# Altium project BusServoCtrl.PrjPcb
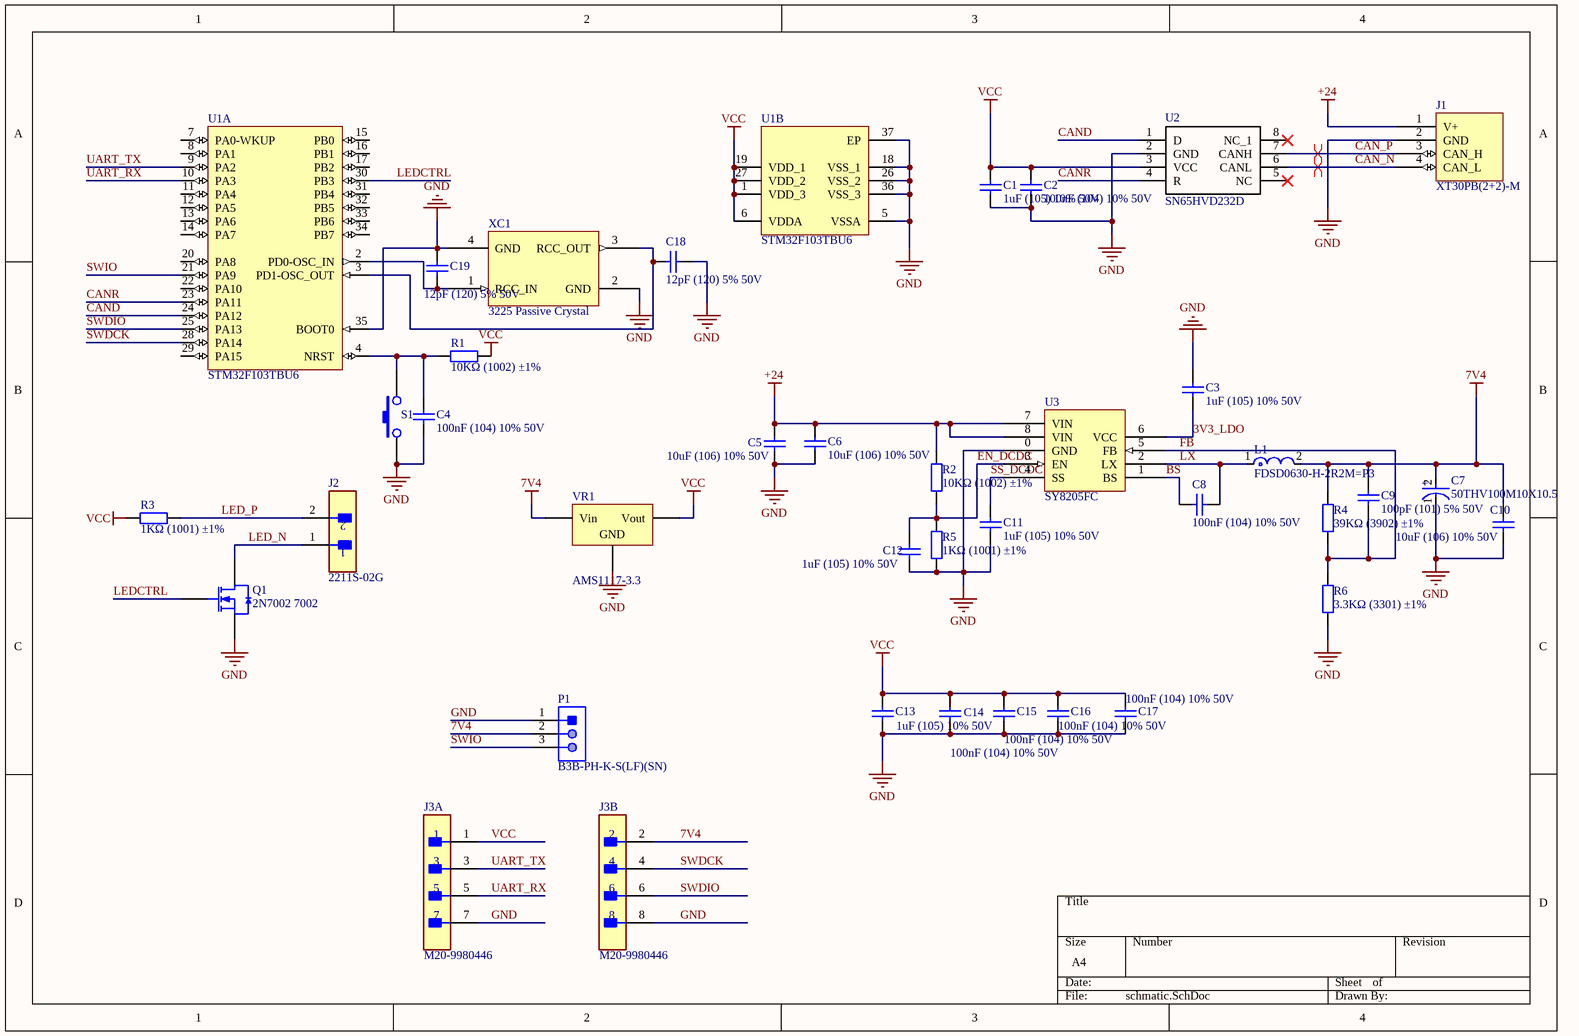
[diagram p0: schmatic.SchDoc]
1 sheet, 37 parts. Net scope: global (net labels, ports and power ports of the same name join across sheets).
Board file: PCB.PcbDoc

## Sheet schmatic.SchDoc
size A4; SheetNumber: 1; SheetTotal: 1

### Parts
C1  1uF (105) 10% 50V  [0603_C]
C2  100nF (104) 10% 50V  [0603_C]
C3  1uF (105) 10% 50V  [0603_C]
C4  100nF (104) 10% 50V  [0603_C]
C5  10uF (106) 10% 50V  [1206_C]
C6  10uF (106) 10% 50V  [1206_C]
C7  50THV100M10X10.5  [FP-THV10X10_5-MFG]
C8  100nF (104) 10% 50V  [0603_C]
C9  100pF (101) 5% 50V  [0603_C]
C10  10uF (106) 10% 50V  [1206_C]
C11  1uF (105) 10% 50V  [0603_C]
C12  1uF (105) 10% 50V  [0603_C]
C13  1uF (105) 10% 50V  [0603_C]
C14  100nF (104) 10% 50V  [0603_C]
C15  100nF (104) 10% 50V  [0603_C]
C16  100nF (104) 10% 50V  [0603_C]
C17  100nF (104) 10% 50V  [0603_C]
C18  12pF (120) 5% 50V  [0603_C]
C19  12pF (120) 5% 50V  [0603_C]
J1  XT30PB(2+2)-M  [XT30PB(2+2)-M-Footprint-1]
J2  2211S-02G  [FP-2211S-02G-MFG]
J3  M20-9980446  [FP-M20-9980446-MFG]  (parts A,B of 2)
L1  FDSD0630-H-2R2M=P3  [FP-FDSD0630-MFG]
P1  B3B-PH-K-S(LF)(SN)  [JST-B3B-PH-K-S-3_V]
Q1  2N7002 7002  [SOT-23(SOT-23-3)]
R1  10KΩ (1002) ±1%  [0603_R]
R2  10KΩ (1002) ±1%  [0603_R]
R3  1KΩ (1001) ±1%  [0603_R]
R4  39KΩ (3902) ±1%  [0603_R]
R5  1KΩ (1001) ±1%  [0603_R]
R6  3.3KΩ (3301) ±1%  [0603_R]
S1  按键  [SWT3*4]  (value not drawn)
U1  STM32F103TBU6  [STM-VFQFPN36_L]  (parts A,B of 2)
U2  SN65HVD232D  [SOIC127P600X175-8N]
U3  SY8205FC  [SOP-8_EP_150mil]
VR1  AMS1117-3.3  [SOT-223]
XC1  3225 Passive Crystal  [SMD-3225]

### Nets
7V4: C7.2(A) C9.2 C10.2 J3.2 L1.2 P1.2 R4.2 VR1.3(Vin)
+24: C5.2 C6.2 J1.1(V+) R2.2 U3.7(VIN) U3.8(VIN)
GND: C1.1 C2.1 C3.2 C4.1 C5.1 C6.1 C7.1(C) C10.1 C11.1 C12.1 C13.1 C14.1 C15.1 C16.1 C17.1 C18.2 C19.2 J1.2(GND) J3.7 J3.8 P1.1 Q1.2(S) R5.1 R6.1 S1.1 U1.5(VSSA) U1.18(VSS_1) U1.26(VSS_2) U1.35(BOOT0) U1.36(VSS_3) U1.37(EP) U2.2(GND) U3.0(GND) VR1.1(GND) XC1.2(GND) XC1.4(GND)
VCC: C1.2 C2.2 C13.2 C14.2 C15.2 C16.2 C17.2 J3.1 R1.2 R3.2 U1.1(VDD_3) U1.6(VDDA) U1.19(VDD_1) U1.27(VDD_2) U2.3(VCC) VR1.2(Vout)
3V3_LDO: C3.1 U3.6(VCC)
BS: C8.1 U3.1(BS)
CAN_N: J1.4(CAN_L) U2.6(CANL)
CAN_P: J1.3(CAN_H) U2.7(CANH)
CAND: U1.24(PA12) U2.1(D)
CANR: U1.23(PA11) U2.4(R)
EN_DCDC: C12.2 R2.1 R5.2 U3.3(EN)
FB: C9.1 R4.1 R6.2 U3.5(FB)
LED_N: J2.1 Q1.3(D)
LED_P: J2.2 R3.1
LEDCTRL: Q1.1(G) U1.30(PB3)
LX: C8.2 L1.1 U3.2(LX)
SS_DCDC: C11.2 U3.4(SS)
SWDCK: J3.4 U1.28(PA14)
SWDIO: J3.6 U1.25(PA13)
SWIO: P1.3 U1.21(PA9)
UART_RX: J3.5 U1.10(PA3)
UART_TX: J3.3 U1.9(PA2)
NetC4_2: C4.2 R1.1 S1.2 U1.4(NRST)
NetC18_1: C18.1 U1.3(PD1-OSC_OUT) XC1.3(RCC_OUT)
NetC19_1: C19.1 U1.2(PD0-OSC_IN) XC1.1(RCC_IN)

Not connected (* = marked no-connect by the designer): U1 7(PA0-WKUP) 8(PA1) 11(PA4) 12(PA5) 13(PA6) 14(PA7) 15(PB0) 16(PB1) 17(PB2) 20(PA8) 22(PA10) 29(PA15) 31(PB4) 32(PB5) 33(PB6) 34(PB7); U2 5(NC)* 8(NC_1)*

### Layout directives
differential pair: CAN_N, CAN_P

### Notes on the sheet
- (in symbol CMP-35376-000015-1) +

### Library data of the parts
C1 C3 C11-C13 = 0603 1uF (105) 10% 50V: 贴片电容; ComponentLink1Description: 供应商链接; ComponentLink1URL: http://www.szlcsc.com/product/details_16531.html; Package: 0603; Supplier: LC; SuppliersPartNumber: C15849
C2 C4 C8 C14-C17 = 0603 100nF (104) 10% 50V: 贴片电容; ComponentLink1Description: 供应商链接; ComponentLink1URL: http://www.szlcsc.com/product/details_15331.html; Package: 0603; Supplier: LC; SuppliersPartNumber: C14663
C5 C6 C10 = 1206 10uF (106) 10% 50V: 贴片电容; ComponentLink1Description: 供应商链接; ComponentLink1URL: http://www.szlcsc.com/product/details_14236.html; Package: 1206; Supplier: LC; SuppliersPartNumber: C13585
C7 = CMP-35376-000015-1: CAP ALUM 100UF 20% 50V SMD; Ripple Current: 175mA; Ripple Current (AC): 350mA; ESR (Equivalent Series Resistance): 250mR; Life (Hours): 3000Hour; Max Operating Temperature: 125°C; Height: 10.5mm; Package Quantity: 1; Radiation Hardening: No; Diameter: 10mm; Capacitance: 100uF; Case/Package: Radial; RoHS Compliant: Yes; Voltage: 50V; REACH SVHC: No SVHC; Packaging: Cut Tape; Height - Seated (Max): 0.413inch; Voltage Rating: 50V; Min Operating Temperature: -40°C; Mount: Surface Mount; Termination: SMD/SMT; Series: THV; Construction: Cylindrical; Voltage Rating (DC): 50V; Tolerance: 20%
C9 = 0603 100pF (101) 5% 50V: 贴片电容; ComponentLink1Description: 供应商链接; ComponentLink1URL: http://www.szlcsc.com/product/details_15530.html; Package: 0603; Supplier: LC; SuppliersPartNumber: C14858
C18 C19 = 0603 12pF (120) 5% 50V: 贴片电容; ComponentLink1Description: 供应商链接; ComponentLink1URL: http://www.szlcsc.com/product/details_39506.html; Package: 0603; Supplier: LC; SuppliersPartNumber: C38523
J1 = CMP-002-00072-5: This is a power connector that can also be used to send/receive can signals; Gender: Male; Pins: 4
J2 = CMP-12414-000006-2: 2.54mm pitch, single row PCB headers.; Gender: Male; Number of Contacts: 2; Insulation Resistance: 1GR; Height: 0.47inch; REACH SVHC: No SVHC; Termination: Through Hole; Contact Material: Copper Alloy; Weight: 0.11lb; Length: 0.2inch; Flammability Rating: UL94 V-0; Contact Plating: Gold; Mount: Through Hole; Number of Rows: 1; RoHS Compliant: No; Width: 0.12inch
J3 = CMP-15831-000088-1: CONN HEADER VERT 8POS 2.54MM; Row Spacing: 0.1inch; Current Rating: 3A; Mated Stacking Heights: 16.54mm; Insulation Resistance: 10GR; Connector Type: Male Pin; Gender: Male; Number of Contacts: 8; Contact Resistance: 30mR; Contact Material: Brass; Series: M20; Max Operating Temperature: 105°C; REACH SVHC: No SVHC; Flammability Rating: UL94 V-0; Number of Rows: 2; Mount: Through Hole; Contact Plating: Tin; Min Operating Temperature: -40°C; Packaging: Bulk; Radiation Hardening: No; Insulation Material: Nylon; Orientation: Straight; Contact Shape: Square; Max Current Rating: 3A; Contact Type: Male Pin; Depth: 5.08mm; Color: Black; Contact Finish - Mating: TIN; Length: 10.16mm; Housing Color: Black; Package Quantity: 1000; Pitch: 2.54mm; Contact Mating Length: 0.24inch; Termination: Solder; Housing Material: Nylon; Fastening Type: Pull; Insulation Color: Black; Number of Positions: 8; RoHS Compliant: Yes
L1 = CMP-06042-016400-1: FIXED IND 2.2UH 7.1A 17 MOHM SMD; Saturation Current: 12A; Test Frequency: 100kHz; DC Resistance (DCR): 17mR; Shielding: Shielded; Tolerance: 20%; Core Material: Ferrite; Height - Seated (Max): 0.118inch; Depth: 6.6mm; Inductance: 2.2uH; Max DC Current: 7.1A; Mount: Surface Mount; Width: 0.26inch; Packaging: Tape and Reel; Case/Package: Nonstandard; Length: 0.276inch; Resistor Type: Wirewound; RoHS Compliant: Yes; Current Rating: 7.1A
P1 = CMP-2000-05164-1: Male Header, Pitch 2 mm, 1 x 3 Position, Height 6 mm, Tail Length 3.4 mm, -25 to 85 degC, RoHS, Bulk; Manufacturer: JST; Style/Orientation: StraightHeader/Plug; Pitch: 2mm; No of Positions: 3; Termination: Crimp; Manufacturer URL: http://www.jst.com/home2.html; Datasheet Version: Oct-06; Type: ShroudedHeader; Datasheet URL: https://datasheet.ciiva.com/11746/0900766b80826550-11746939.pdf
Q1 = 2N7002 7002: MOS(场效应管); ComponentLink1Description: 供应商链接; ComponentLink1URL: http://www.szlcsc.com/product/details_9040.html; Package: SOT-23(SOT-23-3); Supplier: LC; SuppliersPartNumber: C8545
R1 R2 = 0603 10KΩ (1002) 1%: 贴片电阻; ComponentLink1Description: 供应商链接; ComponentLink1URL: http://www.szlcsc.com/product/details_26547.html; Package: 0603; Supplier: LC; SuppliersPartNumber: C25804
R3 R5 = 0603 1KΩ (1001) 1%: 贴片电阻; ComponentLink1Description: 供应商链接; ComponentLink1URL: http://www.szlcsc.com/product/details_21904.html; Package: 0603; Supplier: LC; SuppliersPartNumber: C21190
R4 = 0603 39KΩ (3902) 1%: 贴片电阻; ComponentLink1Description: 供应商链接; ComponentLink1URL: http://www.szlcsc.com/product/details_23880.html; Package: 0603; Supplier: LC; SuppliersPartNumber: C23153
R6 = 0603 3.3KΩ (3301) 1%: 贴片电阻; ComponentLink1Description: 供应商链接; ComponentLink1URL: http://www.szlcsc.com/product/details_23705.html; Package: 0603; Supplier: LC; SuppliersPartNumber: C22978
S1 = Button
U1 = CMP-0237-00055-3: ARM Cortex-M3 32-bit MCU, 128 KB Flash, 20 KB Internal RAM, 26 I/Os, 36-pin VFQFPN, -40 to 85 degC, Tray; FLASH Size (Prog) (kB): 128; Supply Voltage(Vcc) min (V): 2; I/Os (High Current): 26; A/D Converter: 2x12-bit (10 channel); Operating Frequency(F) (Processor speed) (MHz): 72; Internal RAM Size (kB): 20; Mounting Technology: Surface Mount; DatasheetVersion: Rev. 16; Core: ARM Cortex-M3; PackageDescription: 36-Pin Quad Flat No-Lead, 6 x 6 x 1.0 mm Body, 0.5 mm Pitch, Exposed Pad; ComponentLink3Description: Package Specification; Packing: Tray; PartNumber: STM32F103TBU6; PackageVersion: Rev. 16, 08/2013; ComponentLink2URL: http://www.st.com/st-web-ui/static/active/en/resource/technical/document/datasheet/CD00161566.pdf; ComponentLink2Description: Datasheet; ComponentLink3URL: http://www.st.com/st-web-ui/static/active/en/resource/technical/document/datasheet/CD00161561.pdf; ComponentLink1Description: Manufacturer URL; PackageReference: VFQFPN36; ComponentLink1URL: http://www.st.com/web/en/home.html
U2 = SN65HVD232D: 3.3-V CAN TRANSCEIVER; Manufacturer_Name: Texas Instruments; Datasheet Link: http://www.ti.com/lit/ds/symlink/sn65hvd232.pdf; Height: 1.75mm; Manufacturer_Part_Number: SN65HVD232D; Mouser Part Number: 595-SN65HVD232D; Mouser Price/Stock: https://www.mouser.com/Search/Refine.aspx?Keyword=595-SN65HVD232D; RS Part Number: 1977506; RS Price/Stock: http://uk.rs-online.com/web/p/products/1977506
U3 = SY8205FC: 5A, 4.5V-30V Input, Synchronous Step Down Regulator (Buck)
VR1 = SOT-223 AMS1117-3.3: 低压差线性稳压(LDO); ComponentLink1Description: 供应商链接; ComponentLink1URL: http://www.szlcsc.com/product/details_6652.html; Package: SOT-223; Supplier: LC; SuppliersPartNumber: C6186